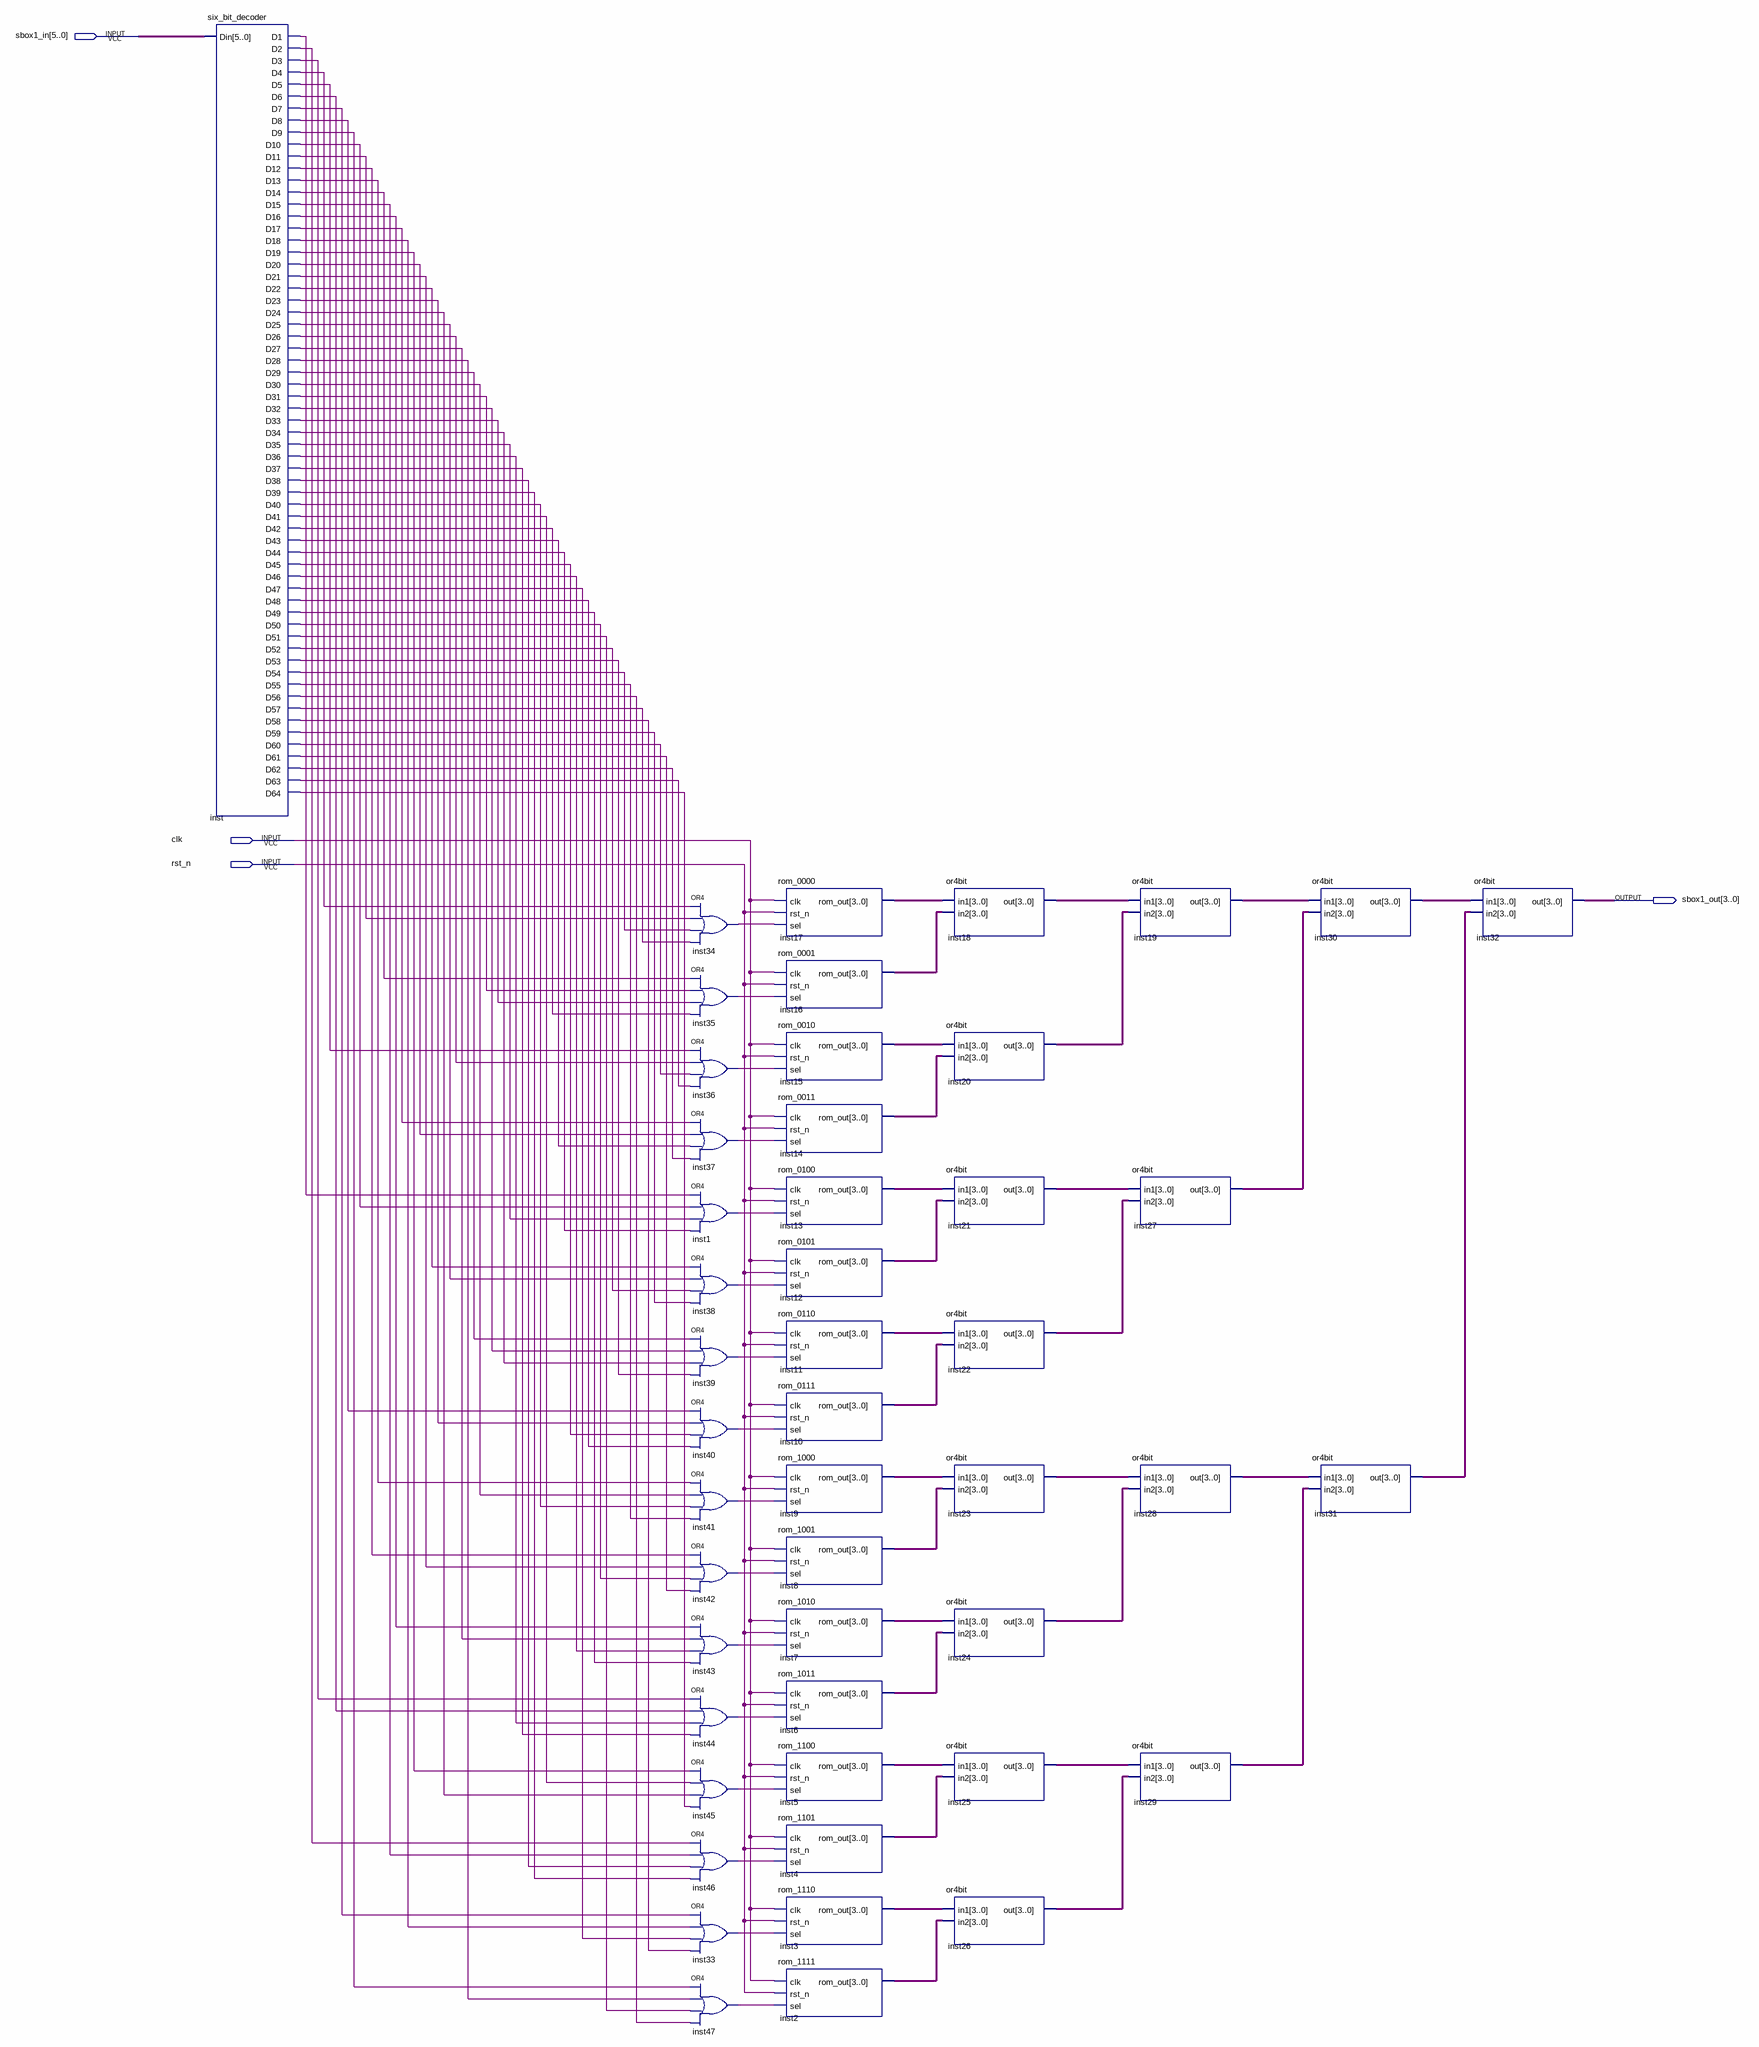
[diagram p0: schematic sheet]
// Quartus schematic s_box_7.bdf as structural Verilog: 48 symbols, 4 pins
module s_box_7 (
  input  [5:0] sbox1_in,
  input  clk,
  input  rst_n,
  output [3:0] sbox1_out
);

  wire inst1_out, inst33_out, inst34_out, inst35_out, inst36_out, inst37_out, inst38_out, inst39_out,
       inst40_out, inst41_out, inst42_out, inst43_out, inst44_out, inst45_out, inst46_out, inst47_out,
       inst_d1, inst_d2, inst_d3, inst_d4, inst_d5, inst_d6, inst_d7, inst_d8, inst_d9, inst_d10, inst_d11,
       inst_d12, inst_d13, inst_d14, inst_d15, inst_d16, inst_d17, inst_d18, inst_d19, inst_d20, inst_d21,
       inst_d22, inst_d23, inst_d24, inst_d25, inst_d26, inst_d27, inst_d28, inst_d29, inst_d30, inst_d31,
       inst_d32, inst_d33, inst_d34, inst_d35, inst_d36, inst_d37, inst_d38, inst_d39, inst_d40, inst_d41,
       inst_d42, inst_d43, inst_d44, inst_d45, inst_d46, inst_d47, inst_d48, inst_d49, inst_d50, inst_d51,
       inst_d52, inst_d53, inst_d54, inst_d55, inst_d56, inst_d57, inst_d58, inst_d59, inst_d60, inst_d61,
       inst_d62, inst_d63, inst_d64;
  wire [3:0] inst2_rom_out, inst3_rom_out, inst4_rom_out, inst5_rom_out, inst6_rom_out, inst7_rom_out,
       inst8_rom_out, inst9_rom_out, inst10_rom_out, inst11_rom_out, inst12_rom_out, inst13_rom_out,
       inst14_rom_out, inst15_rom_out, inst16_rom_out, inst17_rom_out, inst18_out, inst19_out, inst20_out,
       inst21_out, inst22_out, inst23_out, inst24_out, inst25_out, inst26_out, inst27_out, inst28_out,
       inst29_out, inst30_out, inst31_out;

  six_bit_decoder inst (
    .Din(sbox1_in), .D1(inst_d1), .D2(inst_d2), .D3(inst_d3), .D4(inst_d4), .D5(inst_d5), .D6(inst_d6),
    .D7(inst_d7), .D8(inst_d8), .D9(inst_d9), .D10(inst_d10), .D11(inst_d11), .D12(inst_d12), .D13(inst_d13),
    .D14(inst_d14), .D15(inst_d15), .D16(inst_d16), .D17(inst_d17), .D18(inst_d18), .D19(inst_d19),
    .D20(inst_d20), .D21(inst_d21), .D22(inst_d22), .D23(inst_d23), .D24(inst_d24), .D25(inst_d25),
    .D26(inst_d26), .D27(inst_d27), .D28(inst_d28), .D29(inst_d29), .D30(inst_d30), .D31(inst_d31),
    .D32(inst_d32), .D33(inst_d33), .D34(inst_d34), .D35(inst_d35), .D36(inst_d36), .D37(inst_d37),
    .D38(inst_d38), .D39(inst_d39), .D40(inst_d40), .D41(inst_d41), .D42(inst_d42), .D43(inst_d43),
    .D44(inst_d44), .D45(inst_d45), .D46(inst_d46), .D47(inst_d47), .D48(inst_d48), .D49(inst_d49),
    .D50(inst_d50), .D51(inst_d51), .D52(inst_d52), .D53(inst_d53), .D54(inst_d54), .D55(inst_d55),
    .D56(inst_d56), .D57(inst_d57), .D58(inst_d58), .D59(inst_d59), .D60(inst_d60), .D61(inst_d61),
    .D62(inst_d62), .D63(inst_d63), .D64(inst_d64));
  or inst34 (inst34_out, inst_d4, inst_d11, inst_d54, inst_d57);
  or inst35 (inst35_out, inst_d14, inst_d31, inst_d33, inst_d42);
  or inst36 (inst36_out, inst_d5, inst_d26, inst_d60, inst_d63);
  or inst37 (inst37_out, inst_d17, inst_d20, inst_d43, inst_d62);
  or inst1 (inst1_out, inst_d1, inst_d10, inst_d35, inst_d44);
  or inst38 (inst38_out, inst_d22, inst_d25, inst_d52, inst_d59);
  or inst39 (inst39_out, inst_d29, inst_d32, inst_d34, inst_d53);
  or inst40 (inst40_out, inst_d8, inst_d23, inst_d45, inst_d48);
  or inst41 (inst41_out, inst_d13, inst_d30, inst_d40, inst_d55);
  or inst42 (inst42_out, inst_d12, inst_d21, inst_d50, inst_d61);
  or inst43 (inst43_out, inst_d16, inst_d27, inst_d46, inst_d49);
  or inst44 (inst44_out, inst_d3, inst_d6, inst_d36, inst_d37);
  or inst45 (inst45_out, inst_d19, inst_d41, inst_d24, inst_d64);
  or inst46 (inst46_out, inst_d2, inst_d15, inst_d38, inst_d39);
  or inst33 (inst33_out, inst_d7, inst_d18, inst_d47, inst_d58);
  or inst47 (inst47_out, inst_d9, inst_d28, inst_d51, inst_d56);
  rom_0000 inst17 (.clk(clk), .rst_n(rst_n), .sel(inst34_out), .rom_out(inst17_rom_out));
  rom_0001 inst16 (.clk(clk), .rst_n(rst_n), .sel(inst35_out), .rom_out(inst16_rom_out));
  rom_0010 inst15 (.clk(clk), .rst_n(rst_n), .sel(inst36_out), .rom_out(inst15_rom_out));
  rom_0011 inst14 (.clk(clk), .rst_n(rst_n), .sel(inst37_out), .rom_out(inst14_rom_out));
  rom_0100 inst13 (.clk(clk), .rst_n(rst_n), .sel(inst1_out), .rom_out(inst13_rom_out));
  rom_0101 inst12 (.clk(clk), .rst_n(rst_n), .sel(inst38_out), .rom_out(inst12_rom_out));
  rom_0110 inst11 (.clk(clk), .rst_n(rst_n), .sel(inst39_out), .rom_out(inst11_rom_out));
  rom_0111 inst10 (.clk(clk), .rst_n(rst_n), .sel(inst40_out), .rom_out(inst10_rom_out));
  rom_1000 inst9 (.clk(clk), .rst_n(rst_n), .sel(inst41_out), .rom_out(inst9_rom_out));
  rom_1001 inst8 (.clk(clk), .rst_n(rst_n), .sel(inst42_out), .rom_out(inst8_rom_out));
  rom_1010 inst7 (.clk(clk), .rst_n(rst_n), .sel(inst43_out), .rom_out(inst7_rom_out));
  rom_1011 inst6 (.clk(clk), .rst_n(rst_n), .sel(inst44_out), .rom_out(inst6_rom_out));
  rom_1100 inst5 (.clk(clk), .rst_n(rst_n), .sel(inst45_out), .rom_out(inst5_rom_out));
  rom_1101 inst4 (.clk(clk), .rst_n(rst_n), .sel(inst46_out), .rom_out(inst4_rom_out));
  rom_1110 inst3 (.clk(clk), .rst_n(rst_n), .sel(inst33_out), .rom_out(inst3_rom_out));
  rom_1111 inst2 (.clk(clk), .rst_n(rst_n), .sel(inst47_out), .rom_out(inst2_rom_out));
  or4bit inst18 (.in1(inst17_rom_out), .in2(inst16_rom_out), .out(inst18_out));
  or4bit inst20 (.in1(inst15_rom_out), .in2(inst14_rom_out), .out(inst20_out));
  or4bit inst21 (.in1(inst13_rom_out), .in2(inst12_rom_out), .out(inst21_out));
  or4bit inst22 (.in1(inst11_rom_out), .in2(inst10_rom_out), .out(inst22_out));
  or4bit inst23 (.in1(inst9_rom_out), .in2(inst8_rom_out), .out(inst23_out));
  or4bit inst24 (.in1(inst7_rom_out), .in2(inst6_rom_out), .out(inst24_out));
  or4bit inst25 (.in1(inst5_rom_out), .in2(inst4_rom_out), .out(inst25_out));
  or4bit inst26 (.in1(inst3_rom_out), .in2(inst2_rom_out), .out(inst26_out));
  or4bit inst19 (.in1(inst18_out), .in2(inst20_out), .out(inst19_out));
  or4bit inst27 (.in1(inst21_out), .in2(inst22_out), .out(inst27_out));
  or4bit inst28 (.in1(inst23_out), .in2(inst24_out), .out(inst28_out));
  or4bit inst29 (.in1(inst25_out), .in2(inst26_out), .out(inst29_out));
  or4bit inst30 (.in1(inst19_out), .in2(inst27_out), .out(inst30_out));
  or4bit inst31 (.in1(inst28_out), .in2(inst29_out), .out(inst31_out));
  or4bit inst32 (.in1(inst30_out), .in2(inst31_out), .out(sbox1_out));
endmodule
